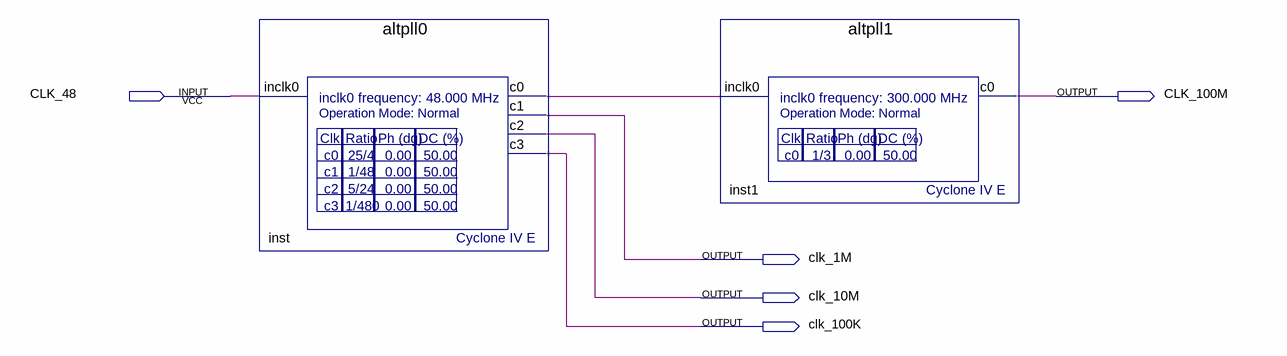
[diagram p0: schematic sheet]
// Quartus schematic PLL.bdf as structural Verilog: 2 symbols, 5 pins
module PLL (
  input  CLK_48,
  output CLK_100M,
  output clk_1M,
  output clk_10M,
  output clk_100K
);

  wire inst_c0;

  altpll0 inst (.inclk0(CLK_48), .c0(inst_c0), .c1(clk_1M), .c2(clk_10M), .c3(clk_100K));
  altpll1 inst1 (.inclk0(inst_c0), .c0(CLK_100M));
endmodule
